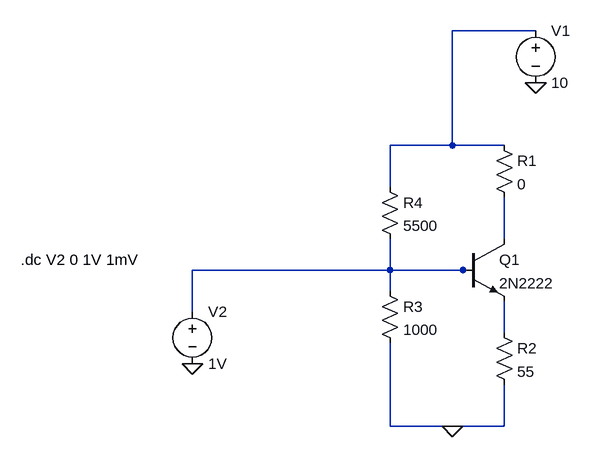
[diagram p0: schematic Common Emitter with 2N2222 -DC conditions.asc]
Common Emitter with 2N2222 -DC conditions.asc, the LTspice schematic file:
Version 4
SHEET 1 880 680
WIRE 272 -256 144 -256
WIRE 144 -80 144 -256
WIRE 144 -80 48 -80
WIRE 224 -80 144 -80
WIRE 48 -16 48 -80
WIRE 224 64 224 0
WIRE 48 112 48 64
WIRE 48 112 -256 112
WIRE 160 112 48 112
WIRE 176 112 160 112
WIRE 48 144 48 112
WIRE -256 176 -256 112
WIRE 224 208 224 160
WIRE 48 352 48 224
WIRE 144 352 48 352
WIRE 224 352 224 288
WIRE 224 352 144 352
FLAG 272 -176 0
FLAG 144 352 0
FLAG -256 256 0
SYMBOL npn 160 64 R0
SYMATTR InstName Q1
SYMATTR Value 2N2222
SYMBOL res 208 -96 R0
SYMATTR InstName R1
SYMATTR Value 0
SYMBOL voltage 272 -272 R0
WINDOW 123 0 0 Left 2
WINDOW 39 0 0 Left 2
SYMATTR InstName V1
SYMATTR Value 10
SYMBOL res 32 -32 R0
SYMATTR InstName R4
SYMATTR Value 5500
SYMBOL res 32 128 R0
SYMATTR InstName R3
SYMATTR Value 1000
SYMBOL res 208 192 R0
SYMATTR InstName R2
SYMATTR Value 55
SYMBOL voltage -256 160 R0
WINDOW 123 0 0 Left 2
WINDOW 39 0 0 Left 2
SYMATTR InstName V2
SYMATTR Value 1V
TEXT -520 96 Left 2 !.dc V2 0 1V 1mV

The netlist it stands for:
* Common Emitter with 2N2222 -DC conditions.asc
Q1 N002 N003 N004 0 2N2222
R1 N001 N002 0
V1 N001 0 10
R4 N001 N003 5500
R3 N003 0 1000
R2 N004 0 55
V2 N003 0 1V
.model NPN NPN
.model PNP PNP
.lib standard.bjt
.dc V2 0 1V 1mV
.backanno
.end